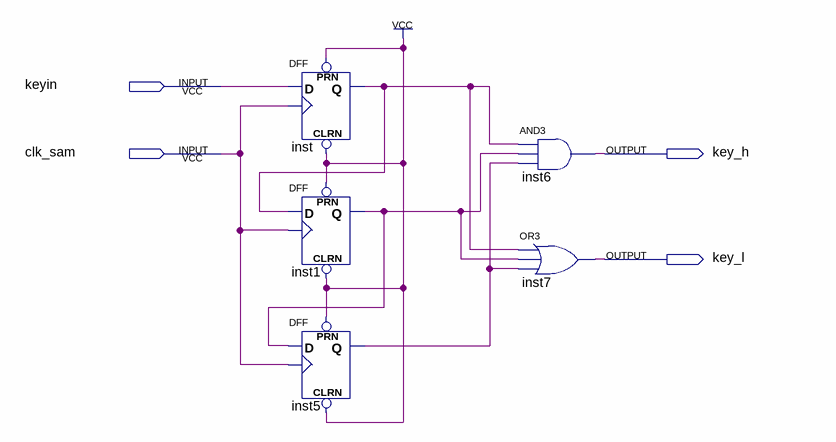
[diagram p0: schematic sheet]
// Quartus schematic key_dounce.bdf as structural Verilog: 5 symbols, 4 pins
module key_dounce (
  input  keyin,
  input  clk_sam,
  output key_h,
  output key_l
);

  wire inst1_q, inst5_q, inst_q;

  DFF inst (.CLRN(1'b1), .CLK(clk_sam), .D(keyin), .PRN(1'b1), .Q(inst_q));
  DFF inst1 (.CLRN(1'b1), .CLK(clk_sam), .D(inst_q), .PRN(1'b1), .Q(inst1_q));
  DFF inst5 (.CLRN(1'b1), .CLK(clk_sam), .D(inst1_q), .PRN(1'b1), .Q(inst5_q));
  and inst6 (key_h, inst_q, inst1_q, inst5_q);
  or inst7 (key_l, inst_q, inst1_q, inst5_q);
endmodule
